# Altium schematic sheet Current_Voltage_measure.SchDoc
size 381 x 241 mm
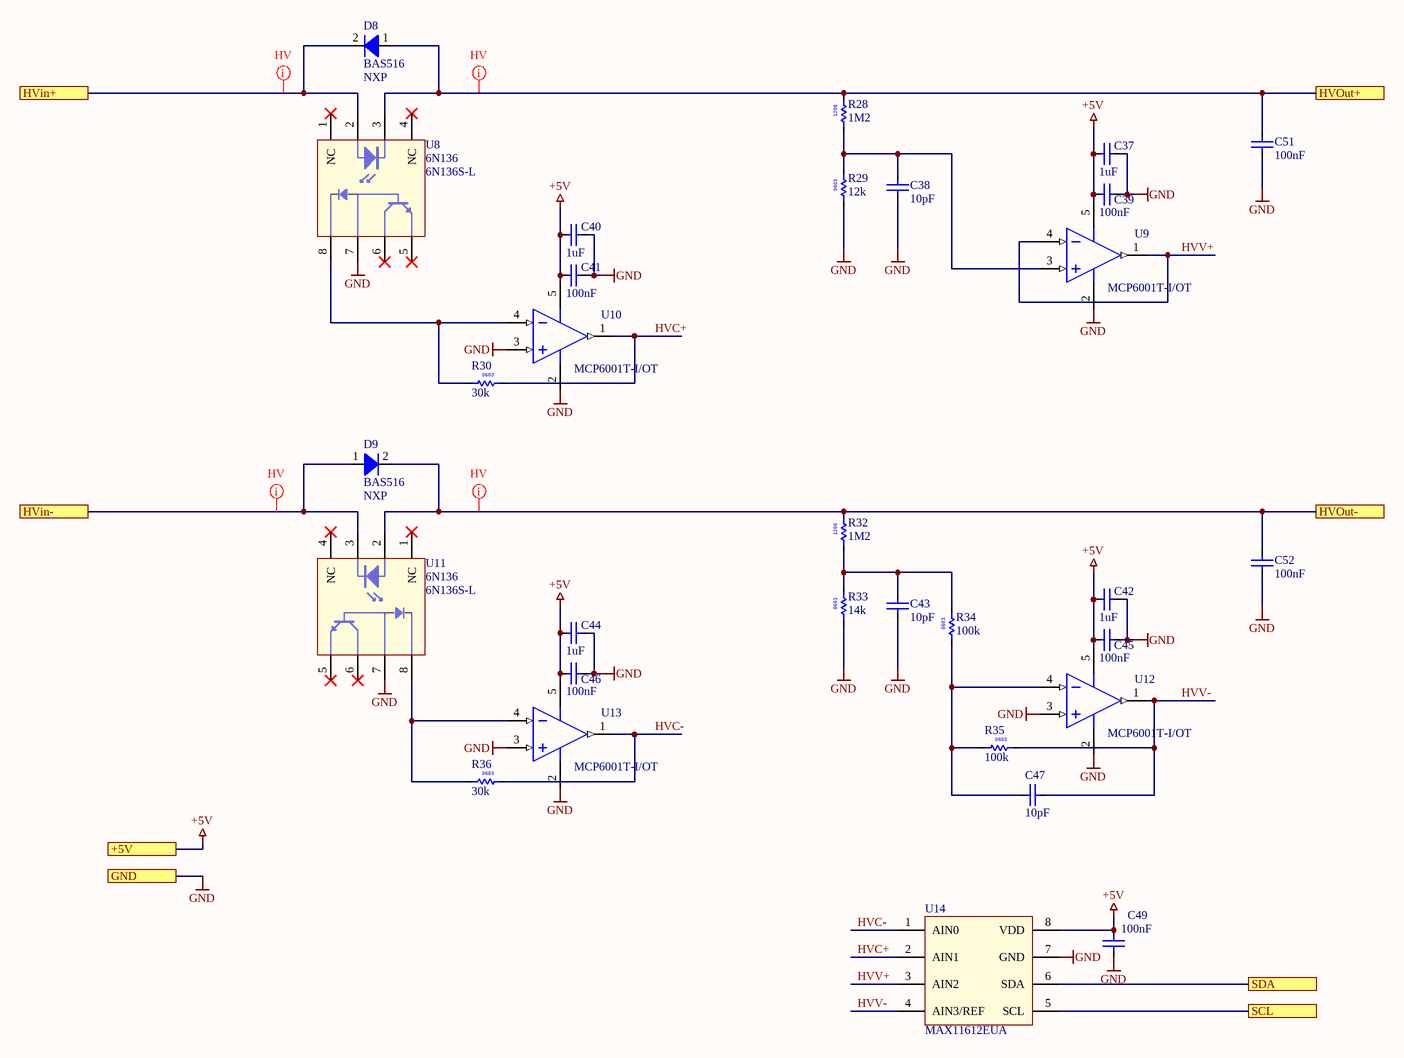
[diagram p0: Current_Voltage_measure.SchDoc]

## Parts
C37  1uF  [CAPC2012N]
C38  10pF  [CAPC1608N]
C39  100nF  [C0603V]
C40  1uF  [CAPC2012N]
C41  100nF  [C0603V]
C42  1uF  [CAPC2012N]
C43  10pF  [CAPC1608N]
C44  1uF  [CAPC2012N]
C45  100nF  [C0603V]
C46  100nF  [C0603V]
C47  10pF  [CAPC1608N]
C49  100nF  [C0603V]
C51  100nF  [C1808]
C52  100nF  [C1808]
D8  BAS516  Manufacturer: NXP  [SOD523]
D9  BAS516  Manufacturer: NXP  [SOD523]
R28  1M2  [RESC3216N]
R29  12k  [RESC1608X50N]
R30  30k  [RESC1608N]
R32  1M2  [RESC3216N]
R33  14k  [RESC1608X50N]
R34  100k  [RESC1608X50N]
R35  100k  [RESC1608X50N]
R36  30k  [RESC1608N]
U8  6N136  Supplier Part Number 1: 6N136S-L  [SMP-8]
U9  MCP6001T-I/OT  [SO-G5/X.45]
U10  MCP6001T-I/OT  [SO-G5/X.45]
U11  6N136  Supplier Part Number 1: 6N136S-L  [SMP-8]
U12  MCP6001T-I/OT  [SO-G5/X.45]
U13  MCP6001T-I/OT  [SO-G5/X.45]
U14  MAX11612EUA  [uMAX-8]

## Ports
+5V, GND, HVin+, HVin-, HVOut+, HVOut-, SCL, SDA

## Nets
+5V: C37.1 C39.2 C40.1 C41.2 C42.1 C44.1 C45.2 C46.2 C49.1 U9.5(V+) U10.5(V+) U12.5(V+) U13.5(V+) U14.8(VDD) ; port +5V
GND: C37.2 C38.1 C39.1 C40.2 C41.1 C42.2 C43.1 C44.2 C45.1 C46.1 C49.2 C51.1 C52.1 R29.1 R33.1 U8.7(Vb) U9.2(V-) U10.2(V-) U10.3(IN+) U11.7(Vb) U12.2(V-) U12.3(IN+) U13.2(V-) U13.3(IN+) U14.7(GND) ; port GND
HVC+: R30.2 U10.1(OUT) U14.2(AIN1)
HVC-: R36.2 U13.1(OUT) U14.1(AIN0)
HVin+: D8.2(cathode) U8.2(A) ; port HVin+
HVin-: D9.1(anode) U11.3(C) ; port HVin-
HVOut+: C51.2 D8.1(anode) R28.2 U8.3(C) ; port HVOut+
HVOut-: C52.2 D9.2(cathode) R32.2 U11.2(A) ; port HVOut-
HVV+: U9.1(OUT) U9.4(IN-) U14.3(AIN2)
HVV-: C47.1 R35.2 U12.1(OUT) U14.4(AIN3/REF)
SCL: U14.5(SCL) ; port SCL
SDA: U14.6(SDA) ; port SDA
NetC38_2: C38.2 R28.1 R29.2 U9.3(IN+)
NetC43_2: C43.2 R32.1 R33.2 R34.2
NetC47_2: C47.2 R34.1 R35.1 U12.4(IN-)
NetR30_1: R30.1 U8.8(Vcc) U10.4(IN-)
NetR36_1: R36.1 U11.8(Vcc) U13.4(IN-)

Not connected (* = marked no-connect by the designer): U8 1(NC)* 4(NC)* 5(GND)* 6(Vo)*; U11 1(NC)* 4(NC)* 5(GND)* 6(Vo)*

## Layout directives
net class HV: HVin+, HVin-, HVOut+, HVOut-

## Notes on the sheet
- (in symbol R0000022) 1206
- (in symbol R0000450) 0603
- (in symbol R0000457) 0603
- (in symbol R0000556) 0603
- (in symbol R2406107) 0603

## Library data of the parts
C37 C40 C42 C44 = C0000037: MLCC, 0805, X5R, 16V, 1uF; Manufacturer: MULTICOMP; Manufacturer Part Number: MCCA000596; Voltage: 16; Tolerance: ±10%; Project: Zhilinskas_I/II/III; Part Number: C0000037; Part Type: MLCC; Material: X5R; Package: 0805 (2012 metric); SMD: Yes; Supplier 1: Farnell; Supplier Part Number 1: 1759479; Price: 0.033; MOQ: 1; Supplier 2: Mouser; Supplier Part Number 2: 77-VJ0805V105ZXJCBC; ComponentLink1Description: MFG link; ComponentLink1URL: http://www.farnell.com/datasheets/462001.pdf; Data: 2011-05-05
C38 C43 C47 = C0000042: MLCC, 0603, NP0, 50V, 10PF; Manufacturer: MULTICOMP; Manufacturer Part Number: MCCA000192; Voltage: 100; Material: C0G / NP0; Project: Zhilinskas_I/II/III; Part Number: C0000042; Part Type: MLCC; Package: 0603 (1608 metric); SMD: Yes; Supplier 1: Farnell; Supplier Part Number 1: 1759053; Price: 0.02; MOQ: 100; Supplier 2: Mouser; Supplier Part Number 2: 77-VJ0603A100JXACBC; ComponentLink1Description: MFG link; ComponentLink1URL: http://www.farnell.com/datasheets/654515.pdf; Data: 2011-06-12
C39 C41 C45 C46 C49 = C0000005: MLCC, 0.1uF 16V 10% X7R 0603; Manufacturer: KEMET; Manufacturer Part Number: C0603C104K4RACTU; Voltage: 16; Project: AUT-RX03-00; Note: 0,041 €; Part Number: C0000005; Part Type: MLCC; Tolerance: 10%; Material: X7R; Package: 0603 (1608 metric); SMD: Yes; Supplier 1: Farnell; Supplier Part Number 1: 1414610RL; Supplier 2: Mouser; Supplier Part Number 2: 80-C0603C104K4R; ComponentLink1Description: MFG link; ComponentLink1URL: http://www.kemet.com/datasheets&C0603C104K4RACTU; Data: 2011.02.27
C51 C52 = C0000111: MLCC, X7R, 100NF, 630V, 1808; Manufacturer: KEMET; Manufacturer Part Number: C1808V104KBRACTU; Voltage: 630; Tolerance: ± 10%; Part Number: C0000111; Part Type: MLCC; Material: X7R; Package: C1808; SMD: Yes; Supplier 1: Farnell; Supplier 2: Mouser; Supplier Part Number 2: 2085209; ComponentLink1Description: MFG link
D8 D9 = D0000081: DIODE, SWITCHING, SOD-523; Vforvard: 1V; Reverse Voltage: 75V; Current: 250mA; Capacitance: 1pF; Part Number: D0000081; Part Type: Diode\Small signal; SMD: Yes; Manufacturer Part Number: BAS516; ComponentLink1Description: MFG link; ComponentLink1URL: http://www.farnell.com/datasheets/1499213.pdf; Data: 2013-01-11; Supplier 1: Farnell; Supplier Part Number 1: 8734402
R28 R32 = R0000022: Res, 1M 0.25W, 1% 1206; Manufacturer: Bourns; Manufacturer Part Number: CR1206-FX-1004ELF; Project: AUT-RX03-00; Note: 0,041 €; R2408042: R0000022; Part type: Thick Film; Tolerance: ±1%; Power: 0.25W; Package: 1206 (3216 metric); SMD: Yes; Supplier 2: Mouser; Supplier Part Number 2: 652-CR1206FX-1004ELF; ComponentLink1Description: Datasheet MFG; ComponentLink1URL: http://www.bourns.com/data/global/pdfs/CHPREZTR.pdf; Data: 2011.03.05
R29 = R0000450: Res, 12K, 0603 (1608 metric), ±1%, 100mW, 75V; Manufacturer: PANASONIC; Manufacturer Part Number: ERJ3EKF1202V; R2408042: R0000450; Part type: Thick Film; Tolerance: ±1%; Power: 100mW; Package: 0603 (1608 metric); SMD: Yes; Supplier 1: Farnell; ComponentLink1Description: MFG link; ComponentLink1URL: http://www.farnell.com/datasheets/1678782.pdf; Data: 2015-09-15
R30 R36 = R2406107: 30K 5% 0603 1/10W; R2408042: R2406107; Part type: Carbon Film; Tolerance: ±5%; Power: 1/10W; Package: 0603 (1608 metric); SMD: Yes; Data: 2011-01-31
R33 = R0000457: Res, 14K, 0603 (1608 metric), ±1%, 100mW, 75V; Manufacturer: PANASONIC; Manufacturer Part Number: ERJ3EKF1402V; R2408042: R0000457; Part type: Thick Film; Tolerance: ±1%; Power: 100mW; Package: 0603 (1608 metric); SMD: Yes; Supplier 1: Farnell; ComponentLink1Description: MFG link; ComponentLink1URL: http://www.farnell.com/datasheets/1678782.pdf; Data: 2015-09-15
R34 R35 = R0000556: Res, 100K, 0603 (1608 metric), ±1%, 100mW, 75V; Manufacturer: PANASONIC; Manufacturer Part Number: ERJ3EKF1003V; R2408042: R0000556; Part type: Thick Film; Tolerance: ±1%; Power: 100mW; Package: 0603 (1608 metric); SMD: Yes; Supplier 1: Farnell; ComponentLink1Description: MFG link; ComponentLink1URL: http://www.farnell.com/datasheets/1678782.pdf; Data: 2015-09-15
U8 U11 = 6N136: 6N136.SDM  Optocoupler, Transistor Output, 1 Channel, Surface Mount DIP, 8 Pins, 50 mA, 5 kV, 19 %; Supplier 1: TME
U9 U10 U12 U13 = MCP6001T-I/OT: MICROCHIP  MCP6001T-I/OT  Operational Amplifier, Single, 1 Amplifier, 1 MHz, 0.6 V/µs, 1.8V to 6V, SOT-23, 5 Pins; Supplier 1: Farnell; Supplier Part Number 1: 4974992
U14 = MAX11612EUA: MAXIM INTEGRATED PRODUCTS  MAX11612EUA+  Analogue to Digital Converter, Low Power, 12 bit, 94.4 kSPS, Single, 4.5 V, 5.5 V, µMAX; Supplier 1: Farnell; Supplier Part Number 1: 2513417